# EasyEDA Pro project ProPrj_ATM 自动柜员机控制系统_2026-04-27.epro

# Schematic 模板
Assembly Variant: Basic; Board Name: 模板; Create Date: 2026-04-27; Page Name: P1; Project Name: 模板; Schematic Name: 模板; Update Date: 2026-04-27; BladeWidth: 10; Company: 嘉立创EDA; Page Size: A4; RegionStart: 1; ShowBorder: 1; TitleBlock: 1; TitleBlockPosition: 3; Version: V1.0; XRegionCount: 6; YRegionCount: 4
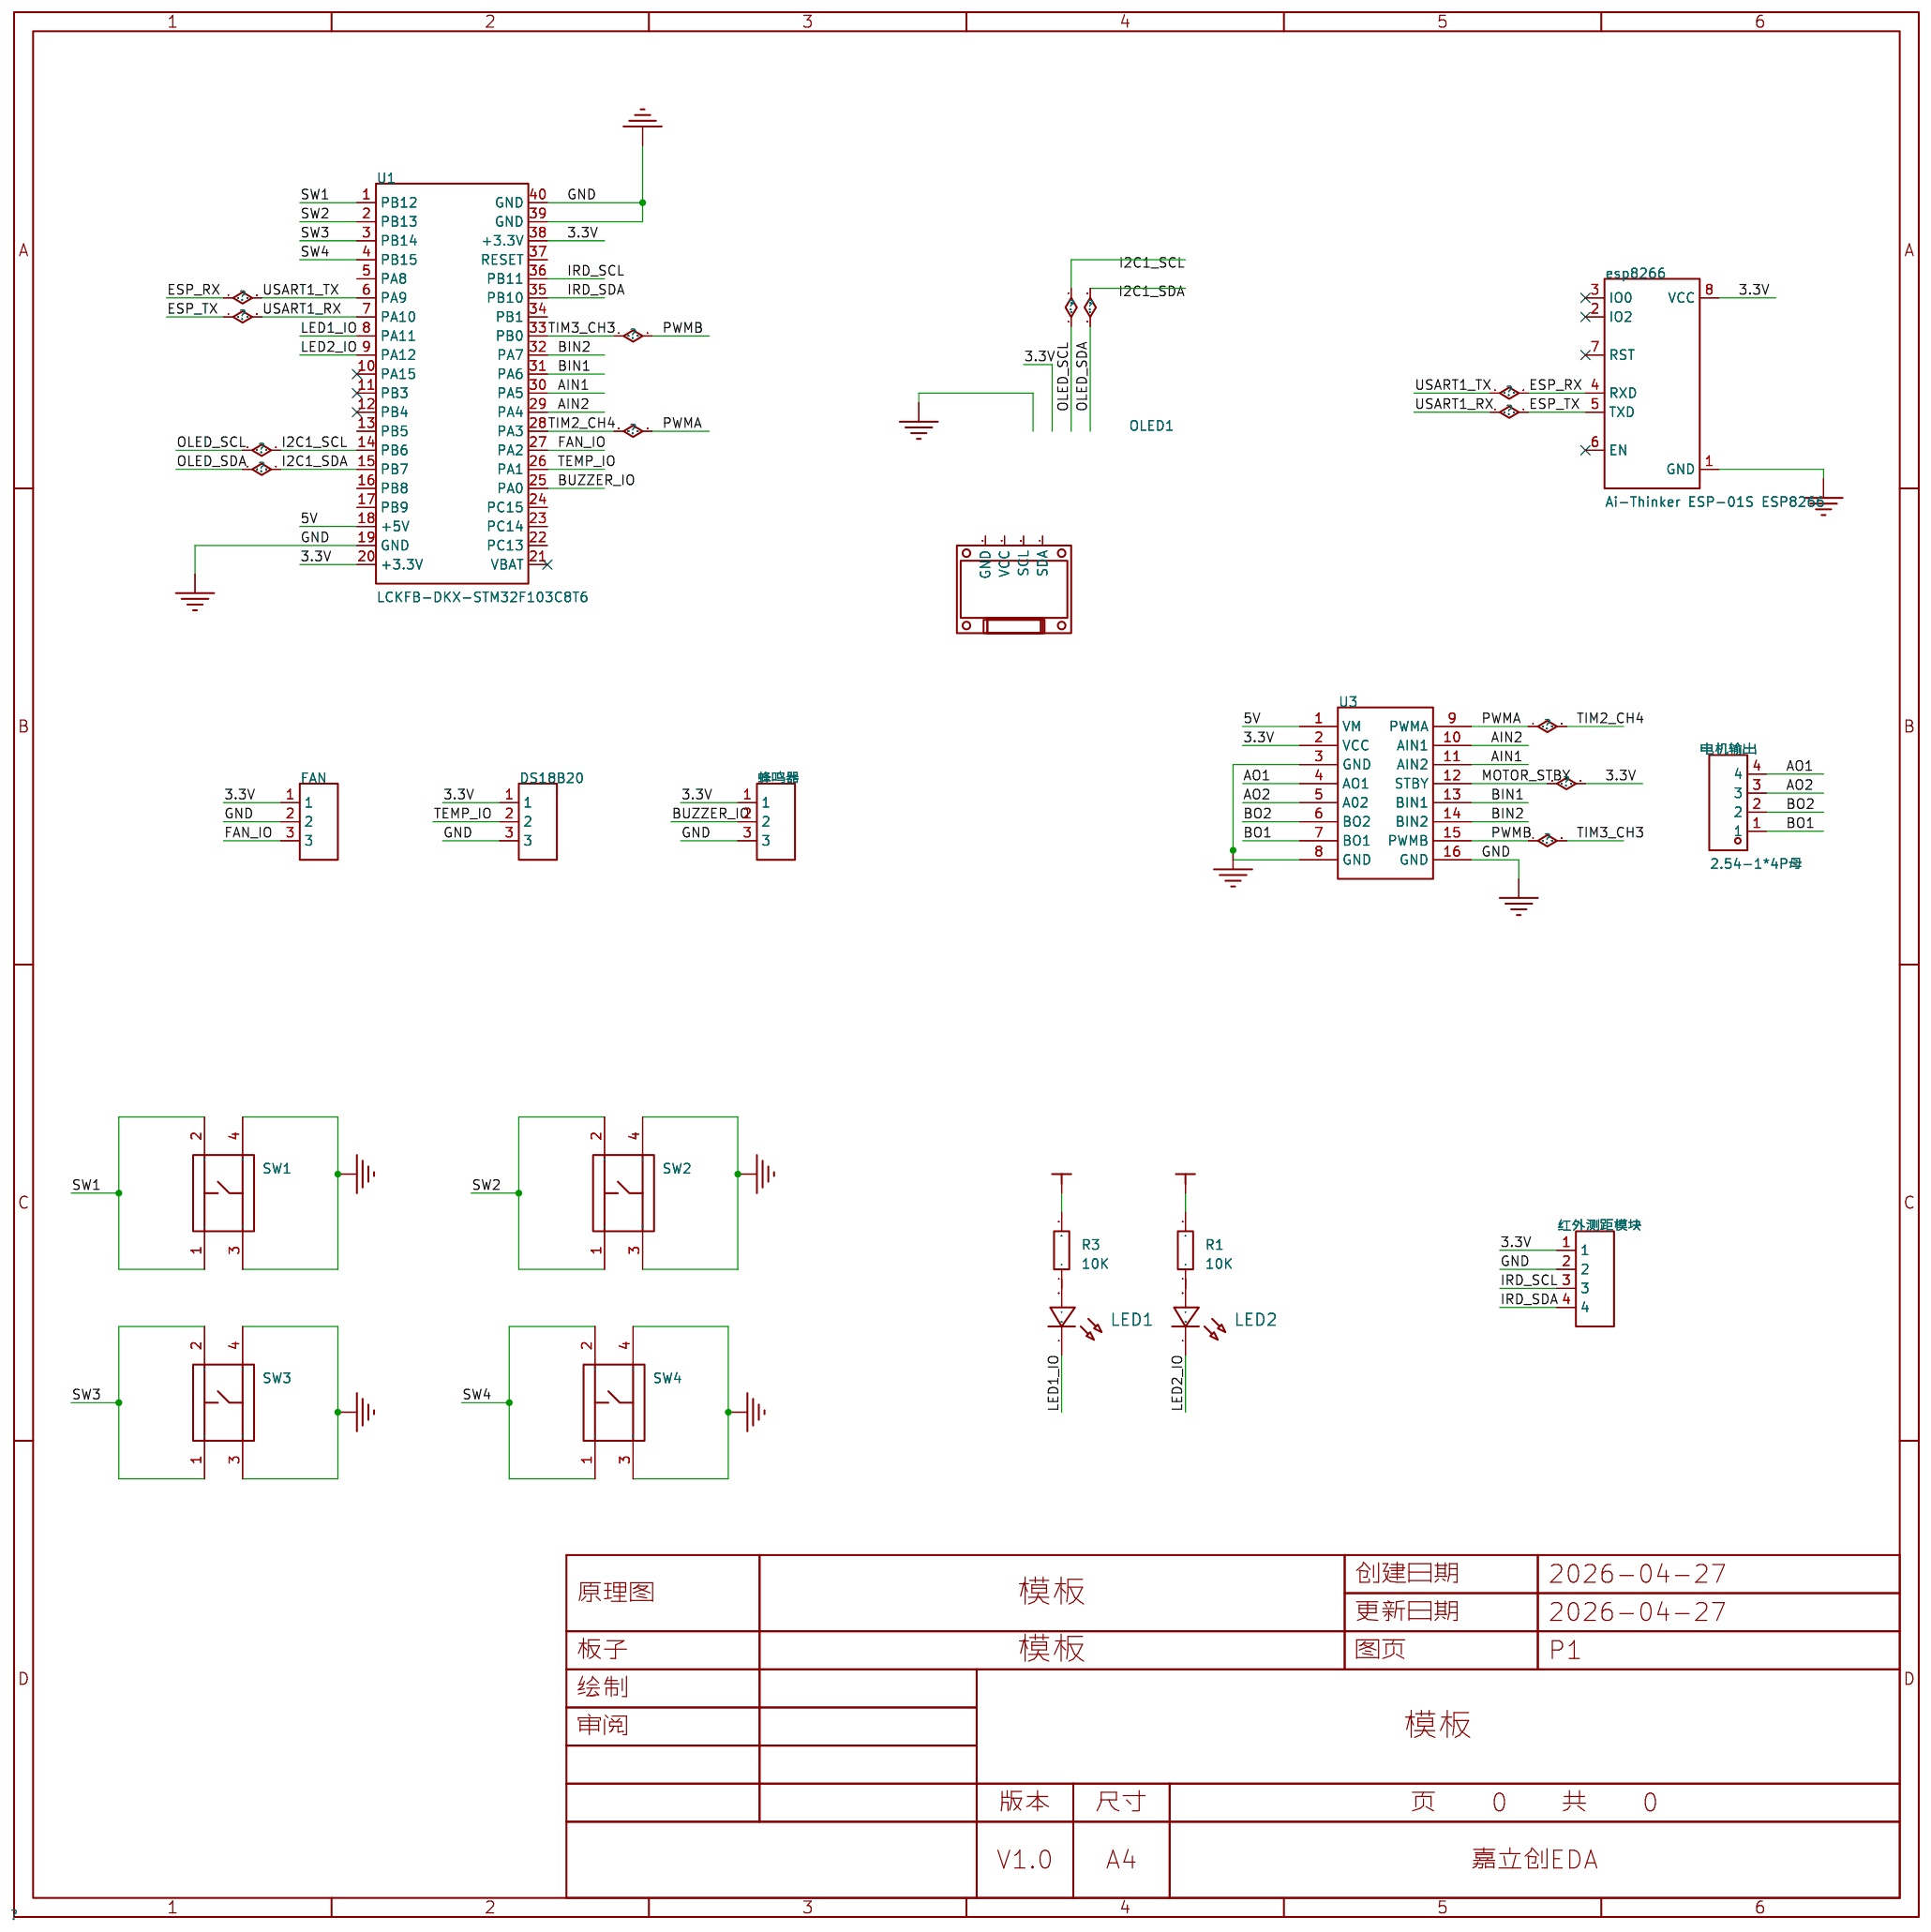
[diagram p0: schematic sheet]

## Parts
DS18B20  -  [HDR-TH_3P-P2.54-V-F]
esp8266  Ai-Thinker ESP-01S ESP8266  [WIFIM-TH_8P-L24.7-W14.4-P2.54]
FAN  -  [HDR-TH_3P-P2.54-V-F]
LED1  -  [LED_0805]
LED2  -  [LED_0805]
OLED1  -  [0.96OLED_4P]
R1  10K  [R0805]
R3  10K  [R0805]
SW1  K2-1102DP-C4SW-04  [KEY-TH_4P-L6.0-W6.0-P4.50-LS6.50]
SW2  K2-1102DP-C4SW-04  [KEY-TH_4P-L6.0-W6.0-P4.50-LS6.50]
SW3  K2-1102DP-C4SW-04  [KEY-TH_4P-L6.0-W6.0-P4.50-LS6.50]
SW4  K2-1102DP-C4SW-04  [KEY-TH_4P-L6.0-W6.0-P4.50-LS6.50]
U1  LCKFB-DKX-STM32F103C8T6  [CONN-TH_L53.3-W22.9_STM32F103C8T6-CARD]
U3  -  [TB6612]
电机输出  2.54-1*4P母  [HDR-TH_4P-P2.54-V-F]
红外测距模块  -  [HDR-TH_4P-P2.54-V-M]
蜂鸣器  -  [HDR-TH_3P-P2.54-V-F]

## Library data of the parts
DS18B20 FAN 蜂鸣器 = HDR-F_2.54_1x3P: Supplier Part: C541850; Supplier Footprint: 插件
esp8266 = Ai-Thinker ESP-01S ESP8266: Supplier Part: C17606792; Manufacturer: Ai-Thinker(安信可); JLCPCB Part Class: Extended Part; Datasheet: https://item.szlcsc.com/datasheet/Ai-Thinker%2520ESP-01S%2520ESP8266/18736031.html; Supplier: LCSC
LED1 LED2 = LED_0805-R: Supplier Footprint: 0805
OLED1 = 0.96OLED模块_4P: Supplier Footprint: 插件
R1 R3 = Res_0805: Supplier Footprint: 0805
SW1-SW4 = K2-1102DP-C4SW-04: 电路结构:单刀单掷;按钮形状:圆形按钮;作用力:2.5N;安装方式:直插;开关长度:6mm;开关宽度:6mm;开关高度:5mm;触点电流:50mA;额定电压:12V;带灯:-;工作寿命:10万次;; LCSC Part Name: 轻触按键开关6*6*5; Supplier Part: C110153; Manufacturer: 韩国韩荣; Supplier Footprint: 插件-4P,6x6mm; JLCPCB Part Class: Extended Part; Datasheet: https://item.szlcsc.com/datasheet/K2-1102DP-C4SW-04/111374.html; Supplier: LCSC; Circuit: 单刀单掷; Actuator Style: 圆形按钮; Operating Force: 2.5N; Mounting Type: 直插; Length: 6mm; Width: 6mm; Switch Height: 5mm; Contact Current: 50mA; Voltage Rating: 12V; Life: 10万次; Operating Temperature: -25℃~+85℃
U1 = LCKFB-DKX-STM32F103C8T6: 搭载Contex M3内核,程序存储容量64KB,RAM总容量20KB,最高72MHz主频,提供高效的计算能力和稳定的运行环境。; LCSC Part Name: 立创·地阔星-STM32F103C8T6开发板; Supplier Part: C22396880; Manufacturer: 立创开发板; JLCPCB Part Class: Extended Part; Datasheet: https://item.szlcsc.com/datasheet/LCKFB-DKX-STM32F103C8T6/24005615.html; Supplier: LCSC
U3 = TB6612
电机输出 = 2.54-1*4P母: 插孔结构:1x4P;间距:2.54mm;行距:-;圆孔/方孔:方孔;安装方式:直插;排数:单排;总孔位数:4P;额定电流:3A;额定电压:-;插孔方向:顶部;塑高:-;触头材质:青铜;触头镀层:-;工作温度:-40℃~+105℃;; LCSC Part Name: 间距:2.54mm 1x4P 直插; Supplier Part: C2718488; Manufacturer: BOOMELE(博穆精密); Supplier Footprint: 插件,P=2.54mm; JLCPCB Part Class: Extended Part; Datasheet: https://item.szlcsc.com/datasheet/2.54-1*4P%25E6%25AF%258D/2834502.html; Supplier: LCSC; Holes Structure: 1x4P; Pitch: 2.54mm; Circular Hole / Square Hole: 方孔; Mounting Type: 直插; Number of Rows: 单排; Number of Positions: 4P; Current Rating: 3A; Holes Direction: 顶部; Contact Material: 青铜; Operating Temperature: -40℃~+105℃
红外测距模块 = HDR-M_2.54_1x4P: Supplier Part: C492403; Supplier Footprint: 插件

## Nets
3.3V: DS18B20.1 esp8266.8(VCC) FAN.1 R1.2 R3.2 U1.20(+3.3V) U1.38(+3.3V) U3.2(VCC) U3.12(STBY) 红外测距模块.1 蜂鸣器.1
5V: U1.18(+5V) U3.1(VM)
GND: DS18B20.3 esp8266.1(GND) FAN.2 SW1.3 SW1.4 SW2.3 SW2.4 SW3.3 SW3.4 SW4.3 SW4.4 U1.19(GND) U1.39(GND) U1.40(GND) U3.3(GND) U3.8(GND) U3.16(GND) 红外测距模块.2 蜂鸣器.3
AIN1: U1.30(PA5) U3.11(AIN2)
AIN2: U1.29(PA4) U3.10(AIN1)
AO1: U3.4(AO1) 电机输出.4
AO2: U3.5(A02) 电机输出.3
BIN1: U1.31(PA6) U3.13(BIN1)
BIN2: U1.32(PA7) U3.14(BIN2)
BO1: U3.7(BO1) 电机输出.1
BO2: U3.6(BO2) 电机输出.2
BUZZER_IO: U1.25(PA0) 蜂鸣器.2
ESP_RX: esp8266.4(RXD) U1.6(PA9)
ESP_TX: esp8266.5(TXD) U1.7(PA10)
FAN_IO: FAN.3 U1.27(PA2)
I2C1_SCL: U1.14(PB6)
I2C1_SDA: U1.15(PB7)
IRD_SCL: U1.36(PB11) 红外测距模块.3
IRD_SDA: U1.35(PB10) 红外测距模块.4
LED1_IO: LED1.1(C) U1.8(PA11)
LED2_IO: LED2.1(C) U1.9(PA12)
PWMA: U1.28(PA3) U3.9(PWMA)
PWMB: U1.33(PB0) U3.15(PWMB)
SW1: SW1.1 SW1.2 U1.1(PB12)
SW2: SW2.1 SW2.2 U1.2(PB13)
SW3: SW3.1 SW3.2 U1.3(PB14)
SW4: SW4.1 SW4.2 U1.4(PB15)
TEMP_IO: DS18B20.2 U1.26(PA1)
$1N106: LED1.2(A) R3.1
$1N109: LED2.2(A) R1.1

Not connected (* = marked no-connect by the designer): esp8266 2(IO2)* 3(IO0)* 6(EN)* 7(RST)*; OLED1 1(GND) 2(VCC) 3(SCL) 4(SDA); U1 5(PA8) 10(PA15)* 11(PB3)* 12(PB4)* 13(PB5) 16(PB8) 17(PB9) 21(VBAT)* 22(PC13) 23(PC14) 24(PC15) 34(PB1) 37(RESET)

# Board 模板
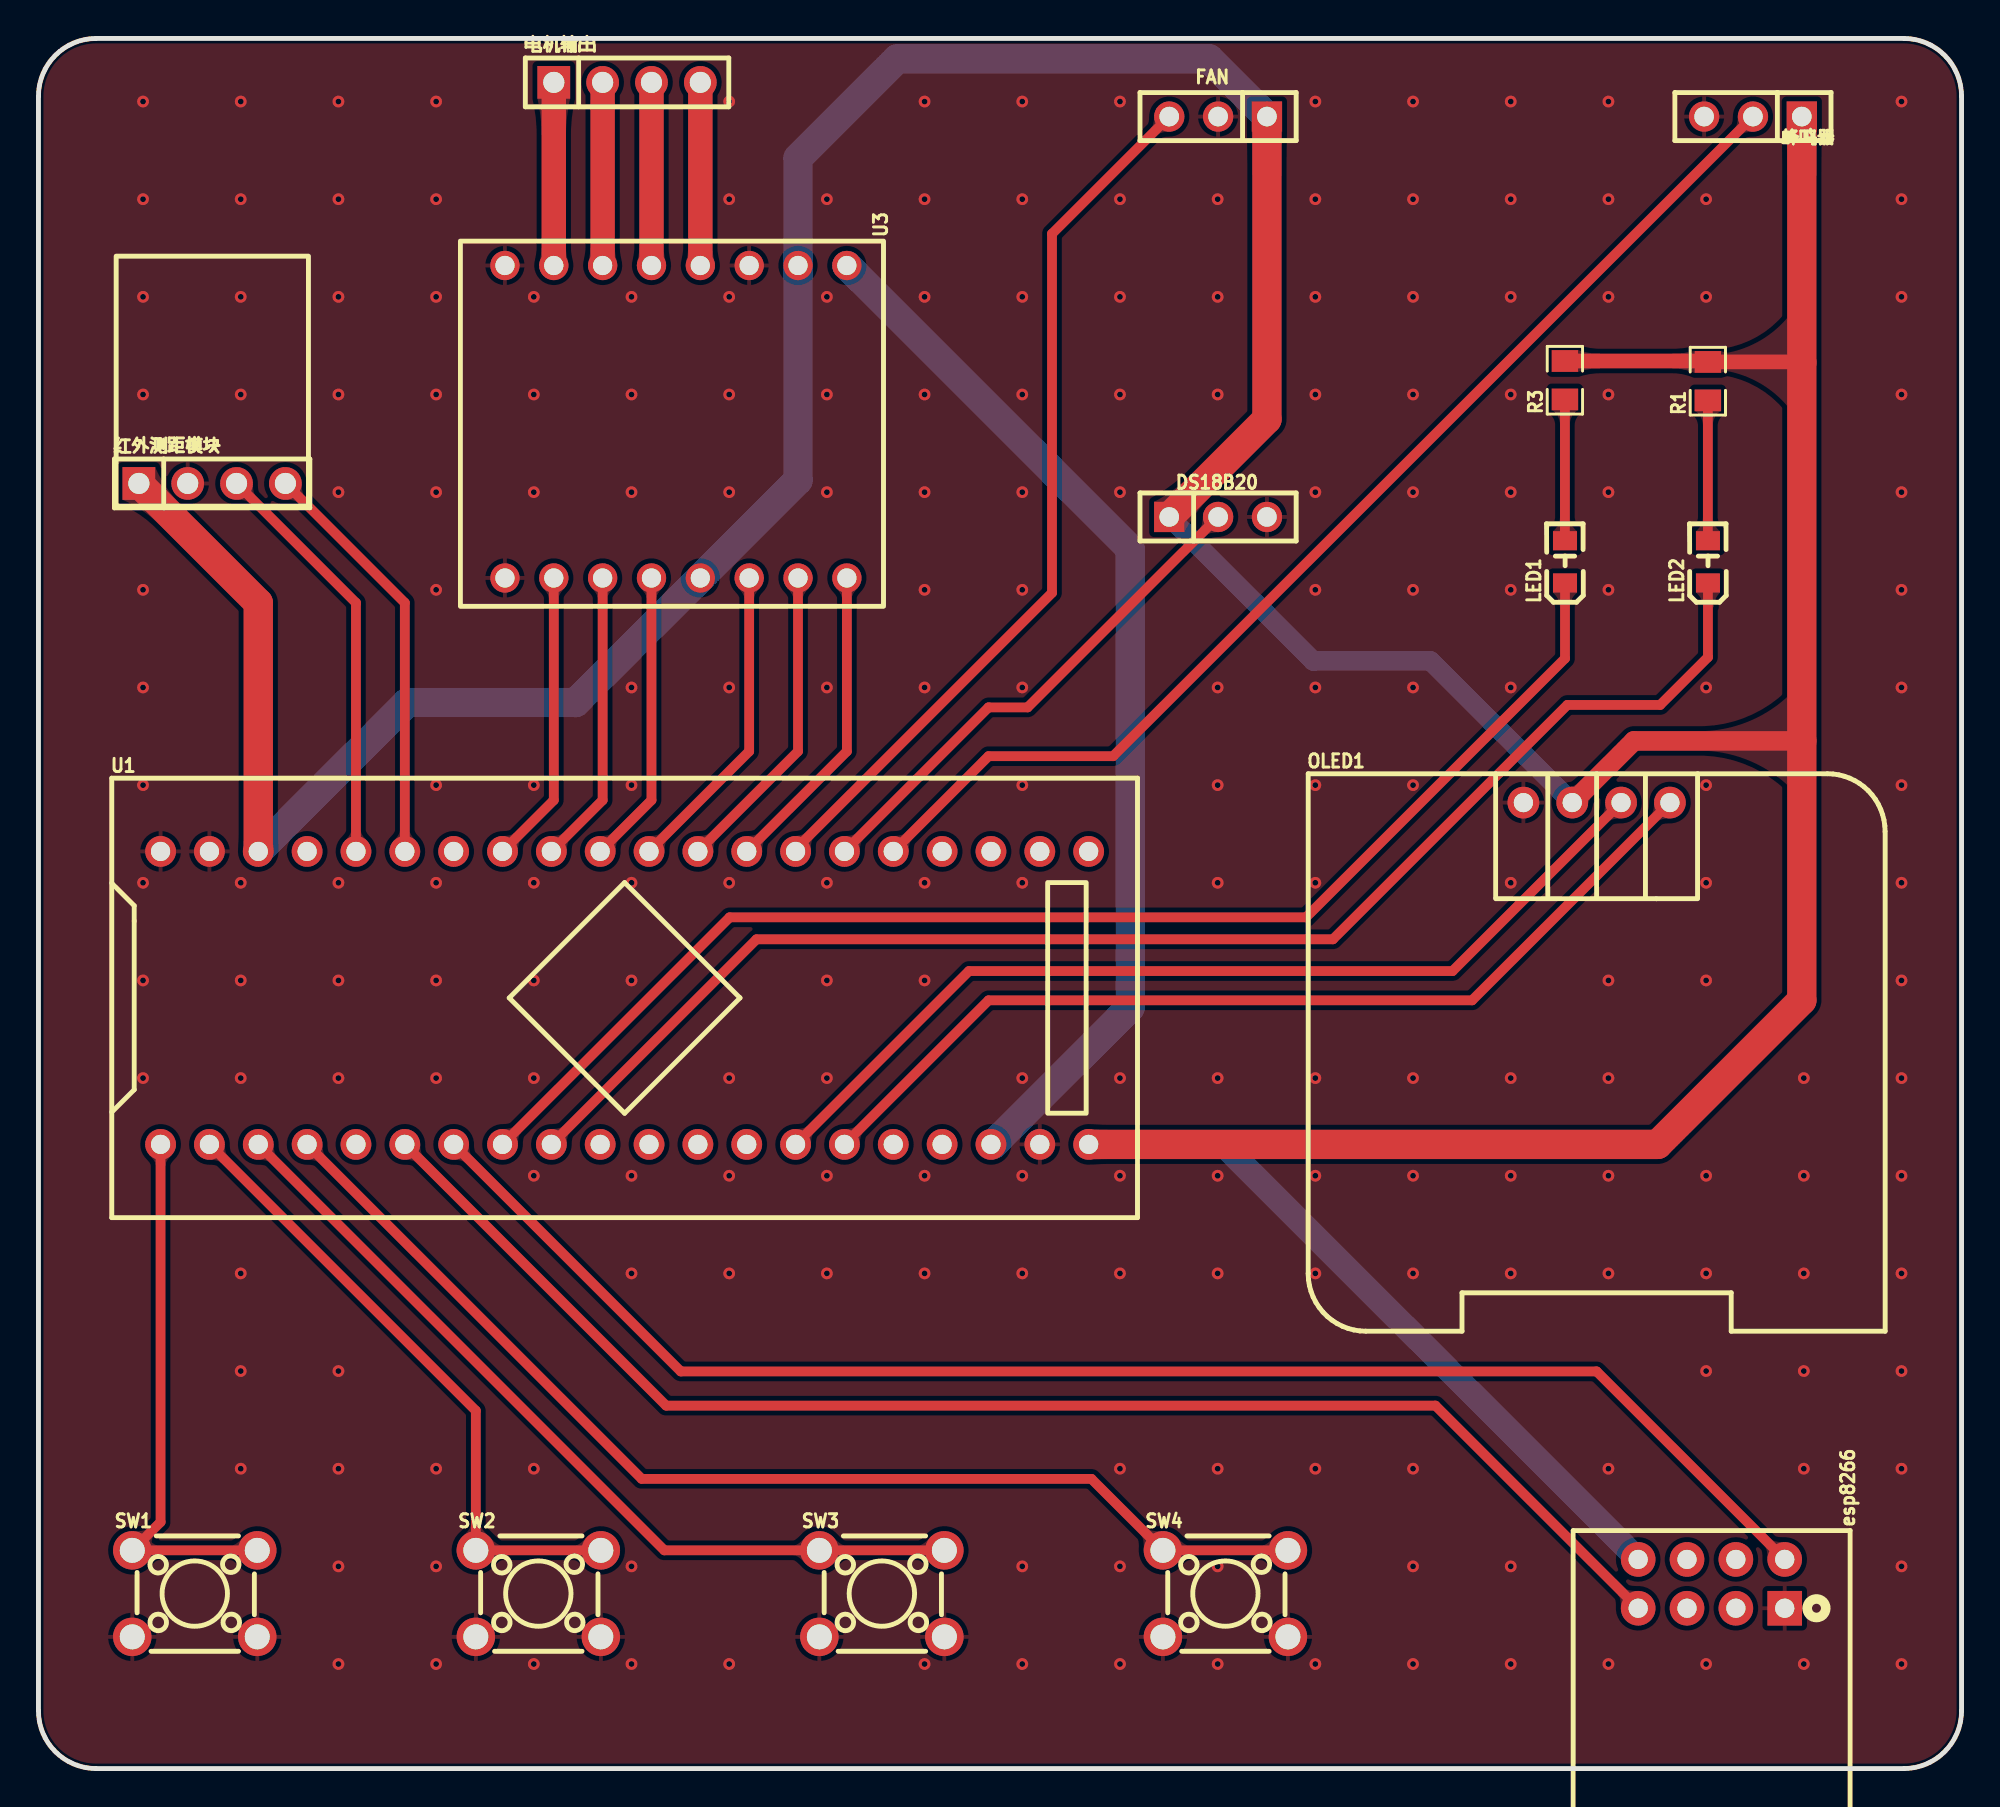
[diagram p1: board, top side]
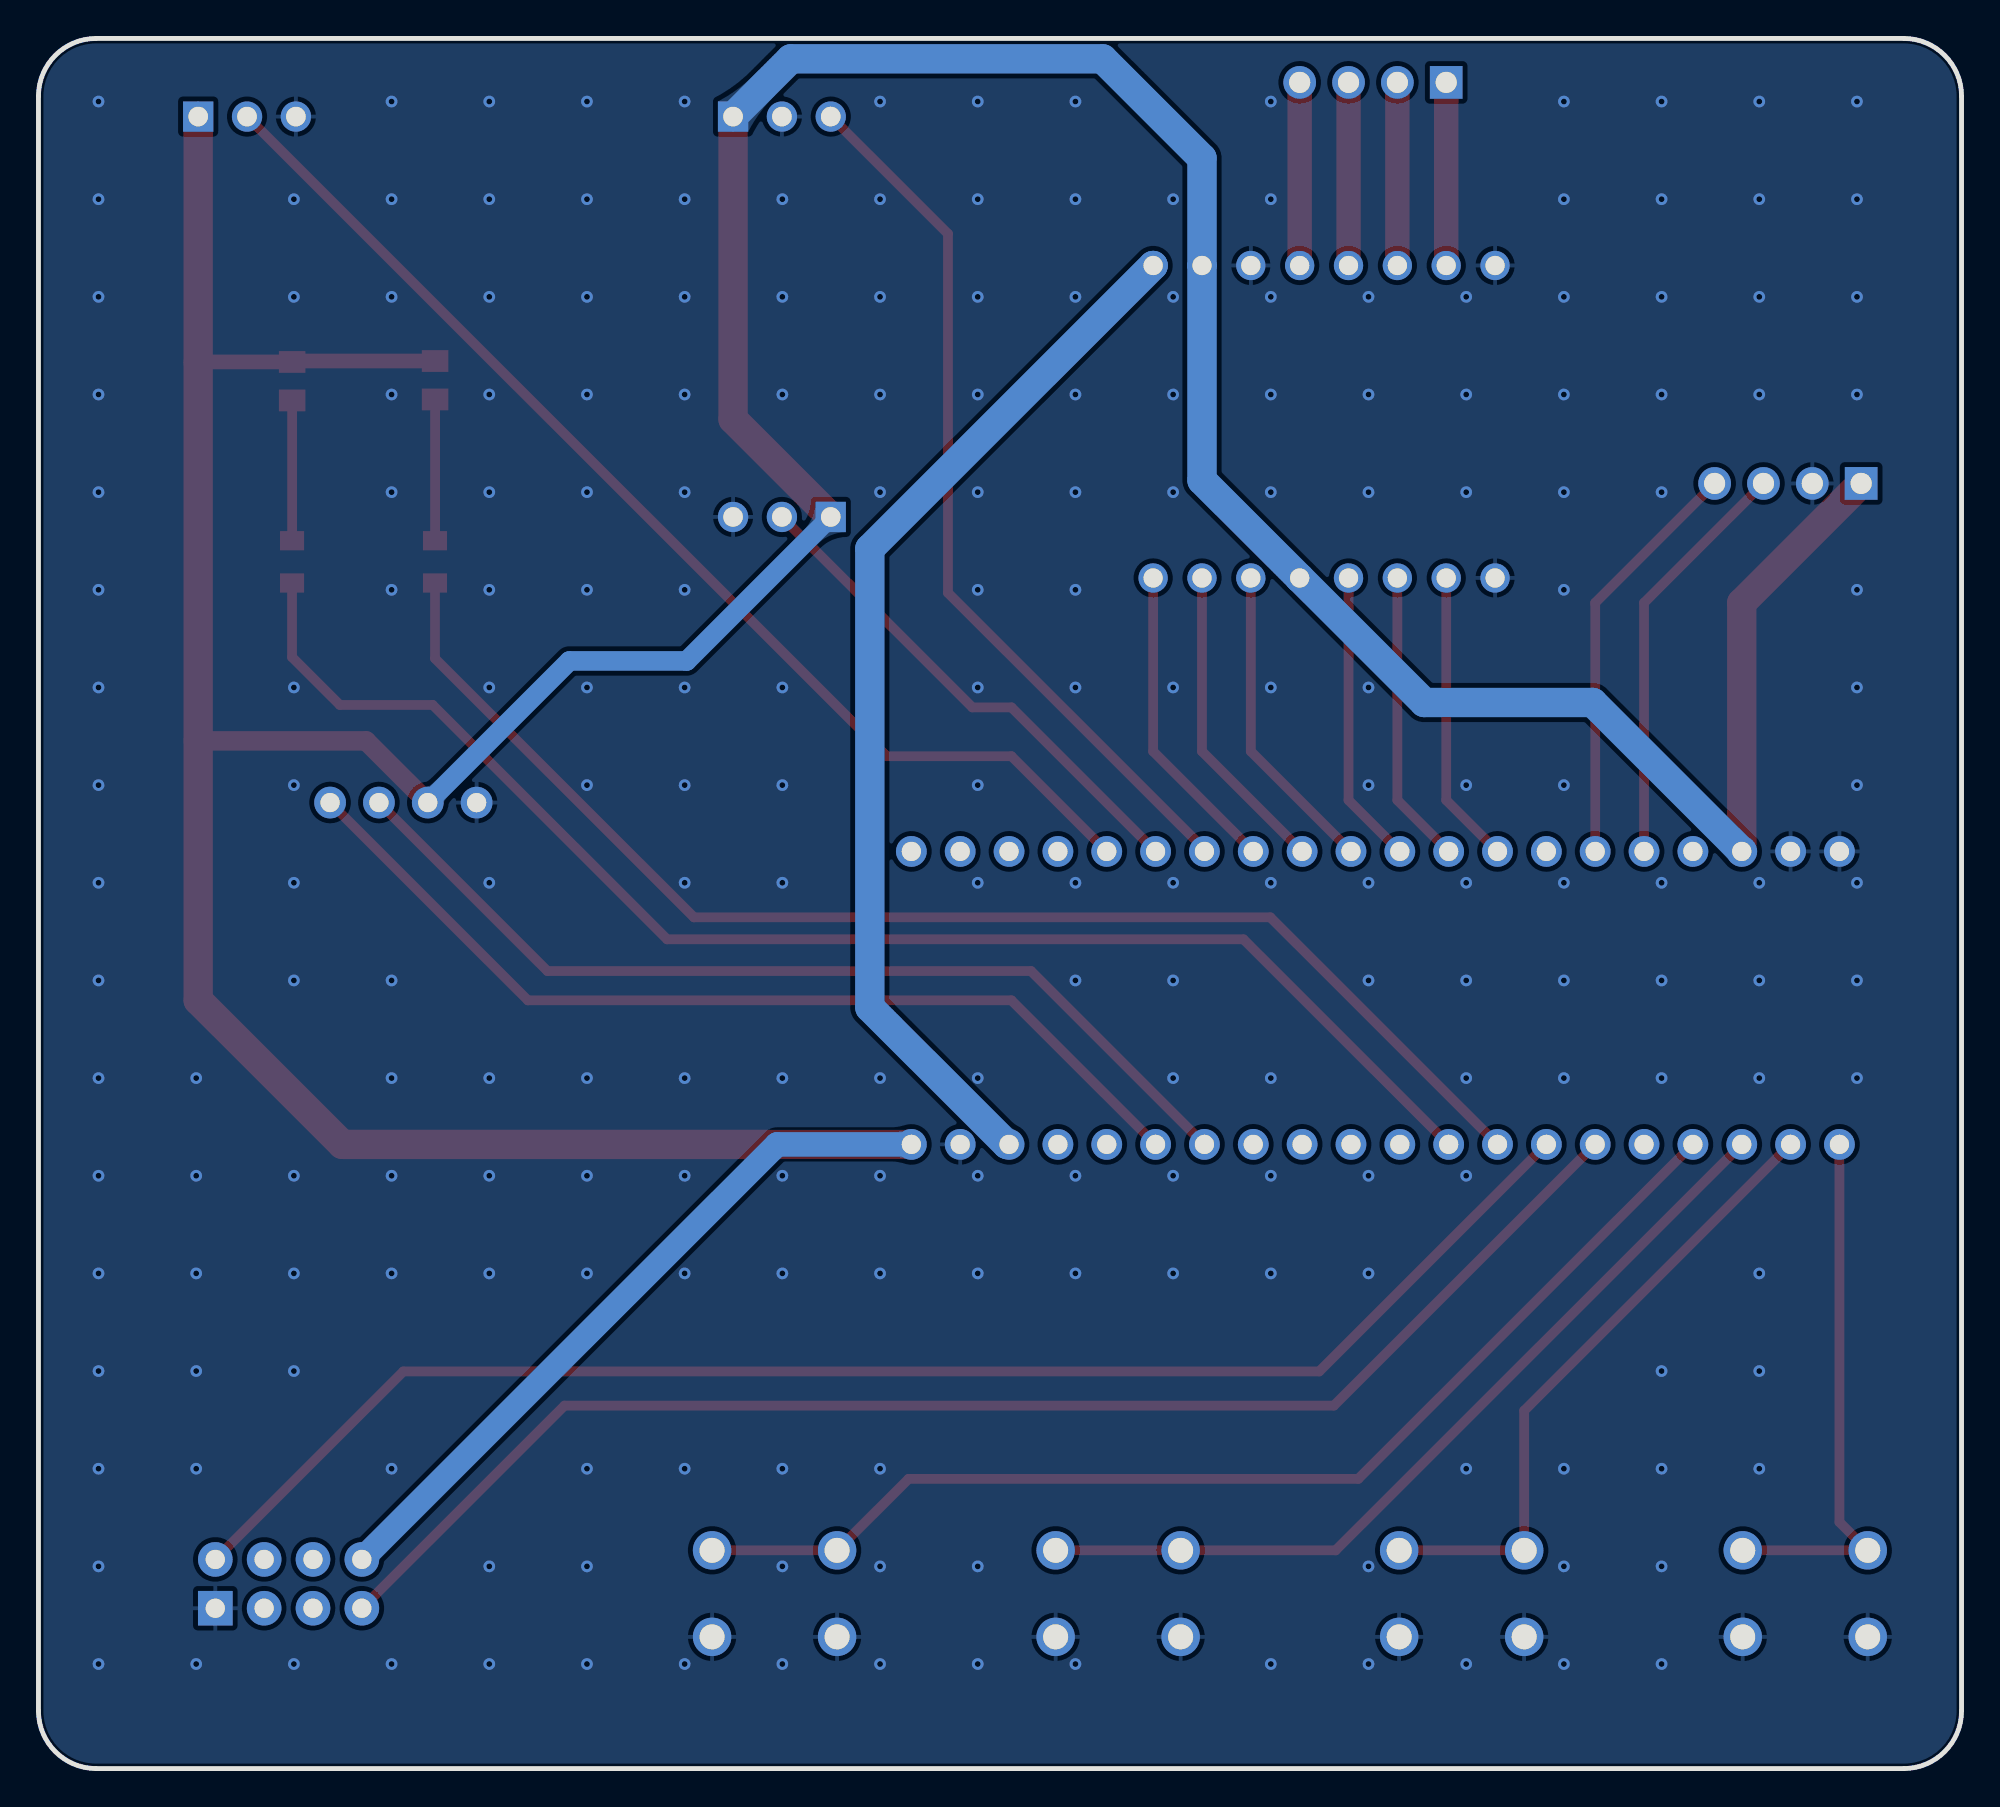
[diagram p2: board, bottom side, seen from below]

Outline 100 x 90 mm; copper layers: Top Layer, Bottom Layer. Coordinates in mm from the lower left corner of the outline.
Outline path: 0,87 0,3 arc(0.88,0.88) 3,0 97,0 arc(99.12,0.88) 100,3 100,87 arc(99.12,89.12) 97,90 3,90 arc(0.88,89.12) 0,87
Stack: Top Layer 0.035mm / Dielectric1 1.51mm FR4 er 4.5 / Bottom Layer 0.035mm

## Design rules (mm)
spacing copperThickness1oz (default): track to track 0.102, other pairs 0.152 to 0.3
spacing copperThickness2oz: track to track 0.203, other pairs 0.152 to 0.3
track width copperThickness1oz (default): min 0.127, default 0.254, max 2.54
track width copperThickness2oz: min 0.203, default 0.254, max 2.54
differential pair differentialPair (default): width min 0.127, default 0.254, max 2.54; gap min 0.152, default 0.152
net GND uses copperRegion

## Placement (name value [footprint] x y rotation side)
DS18B20  -  [HDR-TH_3P-P2.54-V-F]  61.34 65.11 0 top
esp8266  Ai-Thinker ESP-01S ESP8266  [WIFIM-TH_8P-L24.7-W14.4-P2.54]  87 9.61 270 top
FAN  -  [HDR-TH_3P-P2.54-V-F]  61.34 85.94 180 top
LED1  -  [LED_0805]  79.38 62.82 90 top
LED2  -  [LED_0805]  86.82 62.82 90 top
OLED1  -  [0.96OLED_4P]  81.03 50.25 0 top
R1  10K  [R0805]  86.81 72.17 90 top
R3  10K  [R0805]  79.38 72.22 90 top
SW1  K2-1102DP-C4SW-04  [KEY-TH_4P-L6.0-W6.0-P4.50-LS6.50]  8.13 9.1 0 top
SW2  K2-1102DP-C4SW-04  [KEY-TH_4P-L6.0-W6.0-P4.50-LS6.50]  25.99 9.1 0 top
SW3  K2-1102DP-C4SW-04  [KEY-TH_4P-L6.0-W6.0-P4.50-LS6.50]  43.86 9.1 0 top
SW4  K2-1102DP-C4SW-04  [KEY-TH_4P-L6.0-W6.0-P4.50-LS6.50]  61.72 9.1 0 top
U1  LCKFB-DKX-STM32F103C8T6  [CONN-TH_L53.3-W22.9_STM32F103C8T6-CARD]  30.48 40.09 0 top
U3  -  [TB6612]  43.94 79.46 270 top
电机输出  2.54-1*4P母  [HDR-TH_4P-P2.54-V-F]  30.61 87.71 0 top
红外测距模块  -  [HDR-TH_4P-P2.54-V-M]  9.03 66.85 0 top
蜂鸣器  -  [HDR-TH_3P-P2.54-V-F]  89.15 85.94 180 top

## Footprints (pads in the part's own frame, mm; a bottom-side part is the same pattern mirrored in y, then rotated)
0.96OLED_4P
  round 1.65 hole 1: 1(-3.81,-0.002) 2(-1.27,0.002) 3(1.27,0.002) 4(3.81,0.002)
CONN-TH_L53.3-W22.9_STM32F103C8T6-CARD
  round 1.6 hole 1: 1(-24.13,-7.62) 2(-21.59,-7.62) 3(-19.05,-7.62) 4(-16.51,-7.62) 5(-13.97,-7.62) 6(-11.43,-7.62) 7(-8.89,-7.62) 8(-6.35,-7.62) 9(-3.81,-7.62) 10(-1.27,-7.62) 11(1.27,-7.62) 12(3.81,-7.62) 13(6.35,-7.62) 14(8.89,-7.62) 15(11.43,-7.62) 16(13.97,-7.62) 17(16.51,-7.62) 18(19.05,-7.62) 19(21.59,-7.62) 20(24.13,-7.62) 21(24.13,7.62) 22(21.59,7.62) 23(19.05,7.62) 24(16.51,7.62) 25(13.97,7.62) 26(11.43,7.62) 27(8.89,7.62) 28(6.35,7.62) 29(3.81,7.62) 30(1.27,7.62) 31(-1.27,7.62) 32(-3.81,7.62) 33(-6.35,7.62) 34(-8.89,7.62) 35(-11.43,7.62) 36(-13.97,7.62) 37(-16.51,7.62) 38(-19.05,7.62) 39(-21.59,7.62) 40(-24.13,7.62)
HDR-TH_3P-P2.54-V-F
  rect 1.575x1.575 hole 1.02: 1(-2.54,0)
  round 1.575 hole 1.02: 2(0,0) 3(2.54,0)
HDR-TH_4P-P2.54-V-F
  rect 1.7x1.7 hole 1.1: 1(-3.81,0)
  round 1.7 hole 1.1: 2(-1.27,0) 3(1.27,0) 4(3.81,0)
HDR-TH_4P-P2.54-V-M
  rect 1.7x1.7 hole 1.1: 1(-3.81,0)
  round 1.7 hole 1.1: 2(-1.27,0) 3(1.27,0) 4(3.81,0)
KEY-TH_4P-L6.0-W6.0-P4.50-LS6.50
  round 2 hole 1.3: 1(-3.25,2.25) 2(3.25,2.25) 3(-3.25,-2.25) 4(3.25,-2.25)
LED_0805
  rect 1x1.25 smd: 1(-1.15,0.005) 2(1.05,0.005)
R0805
  rect 1.133x1.377 smd: 1(-1,0) 2(1,0)
TB6612
  round 1.524 hole 1: 1(1.27,-1.905) 2(1.27,-4.445) 3(1.27,-6.985) 4(1.27,-9.525) 5(1.27,-12.065) 6(1.27,-14.605) 7(1.27,-17.145) 8(1.27,-19.685) 9(17.526,-1.905) 10(17.526,-4.445) 11(17.526,-6.985) 12(17.526,-9.525) 13(17.526,-12.065) 14(17.526,-14.605) 15(17.526,-17.145) 16(17.526,-19.685)
WIFIM-TH_8P-L24.7-W14.4-P2.54
  rect 1.8x1.8 hole 1: 1(1.27,3.81)
  round 1.8 hole 1: 2(1.27,1.27) 3(1.27,-1.27) 4(1.27,-3.81) 5(-1.27,3.81) 6(-1.27,1.27) 7(-1.27,-1.27) 8(-1.27,-3.81)

## Nets
As in the schematic, except:
3.3V: DS18B20.1 esp8266.8 FAN.1 OLED1.2 R1.2 R3.2 U1.20 U1.38 U3.2 U3.12 红外测距模块.1 蜂鸣器.1
GND: DS18B20.3 esp8266.1 FAN.2 OLED1.1 SW1.3 SW1.4 SW2.3 SW2.4 SW3.3 SW3.4 SW4.3 SW4.4 U1.19 U1.39 U1.40 U3.3 U3.8 U3.16 红外测距模块.2 蜂鸣器.3
I2C1_SCL: OLED1.3 U1.14
I2C1_SDA: OLED1.4 U1.15

Pads without a net: esp8266 2 3 6 7; U1 5 10 11 12 13 16 17 21 22 23 24 34 37

## Via types
v1: diameter 0.61, hole 0.305, Top Layer to Bottom Layer, 222 vias

## Routing (per net, layer and track width the routed paths; a pad name or vN(x,y) marks a point on that pad's centre or on a via; arc(x,y) is an arc through that point)
3.3V: length 301.6
  Top Layer w0.762: 91.69,73.15 91.68,73.17 R1.2 86.76,73.22 R3.2
  Top Layer w1.016: 91.69,53.46 82.96,53.46 OLED1.2
  Top Layer w1.524: 58.8,65.11 63.88,70.19 FAN.1 ; U1.20 84.2,32.47 91.69,39.96 蜂鸣器.1 ; 红外测距模块.1 11.43,60.64 U1.38
  Bottom Layer w1.016: 58.8,65.11 66.29,57.61 72.39,57.61 OLED1.2
  Bottom Layer w1.27: U1.20 61.59,32.47 esp8266.8
  Bottom Layer w1.524: FAN.1 60.88,88.94 44.66,88.94 39.5,83.78 U3.2 39.5,67.01 U3.12 27.94,55.46 19.18,55.46 U1.38
5V: length 54.9
  Bottom Layer w1.524: U3.1 56.77,63.46 56.77,39.59 49.65,32.47 U1.18
GND:
  vias: v1(5.44,86.72) v1(5.44,81.64) v1(5.44,76.56) v1(5.44,71.48) v1(5.44,61.32) v1(5.44,56.24) v1(5.44,51.16) v1(5.44,46.08) v1(5.44,41) v1(5.44,35.92) v1(10.52,86.72) v1(10.52,81.64) v1(10.52,76.56) v1(10.52,71.48) v1(10.52,46.08) v1(10.52,41) v1(10.52,35.92) v1(10.52,25.76) v1(10.52,20.68) v1(10.52,15.6) v1(15.6,86.72) v1(15.6,81.64) v1(15.6,76.56) v1(15.6,71.48) v1(15.6,66.4) v1(15.6,46.08) v1(15.6,41) v1(15.6,35.92) v1(15.6,20.68) v1(15.6,15.6) v1(15.6,10.52) v1(15.6,5.44) v1(20.68,86.72) v1(20.68,81.64) v1(20.68,76.56) v1(20.68,71.48) v1(20.68,66.4) v1(20.68,61.32) v1(20.68,51.16) v1(20.68,46.08) v1(20.68,41) v1(20.68,35.92) v1(20.68,15.6) v1(20.68,10.52) v1(20.68,5.44) v1(25.76,76.56) v1(25.76,71.48) v1(25.76,66.4) v1(25.76,51.16) v1(25.76,46.08) v1(25.76,41) v1(25.76,35.92) v1(25.76,30.84) v1(25.76,15.6) v1(25.76,5.44) v1(30.84,76.56) v1(30.84,71.48) v1(30.84,66.4) v1(30.84,56.24) v1(30.84,51.16) v1(30.84,46.08) v1(30.84,41) v1(30.84,30.84) v1(30.84,25.76) v1(30.84,10.52) v1(30.84,5.44) v1(35.92,86.72) v1(35.92,81.64) v1(35.92,76.56) v1(35.92,71.48) v1(35.92,66.4) v1(35.92,56.24) v1(35.92,46.08) v1(35.92,35.92) v1(35.92,30.84) v1(35.92,25.76) v1(35.92,5.44) v1(41,81.64) v1(41,76.56) v1(41,71.48) v1(41,66.4) v1(41,56.24) v1(41,46.08) v1(41,41) v1(41,35.92) v1(41,30.84) v1(41,25.76) v1(46.08,86.72) v1(46.08,81.64) v1(46.08,76.56) v1(46.08,71.48) v1(46.08,66.4) v1(46.08,61.32) v1(46.08,56.24) v1(46.08,46.08) v1(46.08,41) v1(46.08,30.84) v1(46.08,25.76) v1(46.08,5.44) v1(51.16,86.72) v1(51.16,81.64) v1(51.16,76.56) v1(51.16,71.48) v1(51.16,66.4) v1(51.16,61.32) v1(51.16,56.24) v1(51.16,51.16) v1(51.16,46.08) v1(51.16,35.92) v1(51.16,30.84) v1(51.16,25.76) v1(51.16,10.52) v1(51.16,5.44) v1(56.24,86.72) v1(56.24,81.64) v1(56.24,76.56) v1(56.24,71.48) v1(56.24,66.4) v1(56.24,35.92) v1(56.24,30.84) v1(56.24,25.76) v1(56.24,15.6) v1(56.24,10.52) v1(56.24,5.44) v1(61.32,81.64) v1(61.32,76.56) v1(61.32,71.48) v1(61.32,56.24) v1(61.32,51.16) v1(61.32,46.08) v1(61.32,35.92) v1(61.32,30.84) v1(61.32,25.76) v1(61.32,15.6) v1(61.32,10.52) v1(61.32,5.44) v1(66.4,86.72) v1(66.4,81.64) v1(66.4,76.56) v1(66.4,71.48) v1(66.4,66.4) v1(66.4,61.32) v1(66.4,56.24) v1(66.4,51.16) v1(66.4,46.08) v1(66.4,35.92) v1(66.4,30.84) v1(66.4,25.76) v1(66.4,15.6) v1(66.4,5.44) v1(71.48,86.72) v1(71.48,81.64) v1(71.48,76.56) v1(71.48,71.48) v1(71.48,66.4) v1(71.48,61.32) v1(71.48,56.24) v1(71.48,51.16) v1(71.48,35.92) v1(71.48,30.84) v1(71.48,25.76) v1(71.48,15.6) v1(71.48,10.52) v1(71.48,5.44) v1(76.56,86.72) v1(76.56,81.64) v1(76.56,76.56) v1(76.56,71.48) v1(76.56,66.4) v1(76.56,61.32) v1(76.56,56.24) v1(76.56,46.08) v1(76.56,35.92) v1(76.56,30.84) v1(76.56,25.76) v1(76.56,10.52) v1(76.56,5.44) v1(81.64,86.72) v1(81.64,81.64) v1(81.64,76.56) v1(81.64,71.48) v1(81.64,66.4) v1(81.64,61.32) v1(81.64,41) v1(81.64,35.92) v1(81.64,30.84) v1(81.64,25.76) v1(81.64,15.6) v1(81.64,5.44) v1(86.72,81.64) v1(86.72,76.56) v1(86.72,56.24) v1(86.72,51.16) v1(86.72,46.08) v1(86.72,41) v1(86.72,30.84) v1(86.72,25.76) v1(86.72,20.68) v1(86.72,5.44) v1(91.8,35.92) v1(91.8,30.84) v1(91.8,25.76) v1(91.8,20.68) v1(91.8,15.6) v1(91.8,5.44) v1(96.88,86.72) v1(96.88,81.64) v1(96.88,76.56) v1(96.88,71.48) v1(96.88,66.4) v1(96.88,61.32) v1(96.88,56.24) v1(96.88,51.16) v1(96.88,46.08) v1(96.88,41) v1(96.88,35.92) v1(96.88,30.84) v1(96.88,25.76) v1(96.88,20.68) v1(96.88,15.6) v1(96.88,10.52) v1(96.88,5.44)
AIN1: length 16.4
  Top Layer w0.508: U3.11 36.96,52.92 U1.30
AIN2: length 16.4
  Top Layer w0.508: U3.10 39.5,52.92 U1.29
AO1: length 9.5
  Top Layer w1.27: 电机输出.4 U3.4
AO2: length 9.5
  Top Layer w1.27: 电机输出.3 U3.5
BIN1: length 15.3
  Top Layer w0.508: U1.31 31.88,50.38 U3.13
BIN2: length 15.3
  Top Layer w0.508: 29.34,61.93 29.34,50.38 U1.32
BO1: length 9.5
  Top Layer w1.27: 电机输出.1 26.8,78.19
BO2: length 9.5
  Top Layer w1.27: 29.34,78.19 电机输出.2
BUZZER_IO: length 60.5
  Top Layer w0.508: 蜂鸣器.2 55.88,52.66 49.4,52.66 U1.25
ESP_RX: length 74.1
  Top Layer w0.508: U1.6 32.64,18.88 72.64,18.88 esp8266.4
ESP_TX: length 78.2
  Top Layer w0.508: esp8266.5 81.03,20.66 33.4,20.66 U1.7
FAN_IO: length 46.3
  Top Layer w0.508: U1.27 39.37,47.83 52.71,61.16 52.71,79.84 58.8,85.94
I2C1_SCL: length 50.3
  Top Layer w0.508: U1.14 48.39,41.49 73.53,41.49 OLED1.3
I2C1_SDA: length 50.3
  Top Layer w0.508: U1.15 49.4,39.96 74.55,39.96 OLED1.4
IRD_SCL: length 21.7
  Top Layer w0.508: U1.36 16.51,60.64 红外测距模块.3
IRD_SDA: length 21.7
  Top Layer w0.508: 红外测距模块.4 19.05,60.64 U1.35
LED1_IO: length 69.6
  Top Layer w0.508: U1.8 35.94,44.28 65.91,44.28 79.38,57.75 LED1.1
LED2_IO: length 74.5
  Top Layer w0.508: LED2.1 86.81,57.81 84.33,55.33 79.5,55.33 67.31,43.14 37.34,43.14 U1.9
PWMA: length 16.4
  Top Layer w0.508: U3.9 42.04,52.92 U1.28
PWMB: length 15.3
  Top Layer w0.508: 26.8,61.93 26.8,50.38 U1.33
SW1: length 28.2
  Top Layer w0.508: SW1.2 SW1.1 6.35,12.82 U1.1
SW2: length 33.4
  Top Layer w0.508: SW2.2 SW2.1 22.74,18.62 U1.2
SW3: length 44.4
  Top Layer w0.508: SW3.2 SW3.1 32.55,11.35 U1.3
SW4: length 59.7
  Top Layer w0.508: SW4.2 SW4.1 54.75,15.07 31.37,15.07 U1.4
TEMP_IO: length 26.6
  Top Layer w0.508: DS18B20.2 51.44,55.2 49.4,55.2 U1.26
$1N106: length 7.4
  Top Layer w0.508: LED1.2 79.38,63.88 R3.1
$1N109: length 7.3
  Top Layer w0.508: LED2.2 86.81,63.88 R1.1

## Copper pours and planes (outline as drawn; the poured copper is in the pictures)
GND on Top Layer: -14.61,120.86 120.52,120.86 120.52,-19.6 -14.61,-19.6
GND on Bottom Layer: -30.1,122.13 153.03,122.13 153.03,-28.75 -30.1,-28.75

Small or netless copper shapes (teardrops, artwork), in the pictures only: 84 on Top Layer, 7 on Bottom Layer
